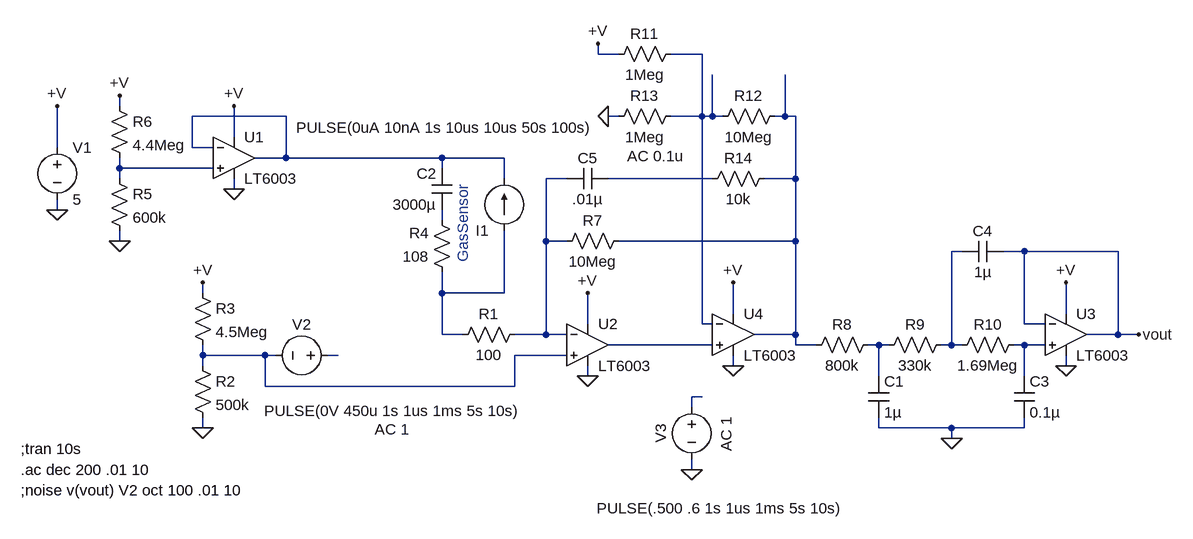
[diagram p0: schematic 6003_H2S_sensor_wFilter_10Meg_decomped in the loop.asc]
6003_H2S_sensor_wFilter_10Meg_decomped in the loop.asc, the LTspice schematic file:
Version 4
SHEET 1 1116 680
WIRE 208 -288 208 -304
WIRE 240 -288 208 -288
WIRE 368 -288 320 -288
WIRE -528 -208 -528 -224
WIRE -272 -192 -416 -192
WIRE 240 -192 224 -192
WIRE 368 -192 368 -288
WIRE 368 -192 320 -192
WIRE 384 -192 384 -256
WIRE 384 -192 368 -192
WIRE 400 -192 384 -192
WIRE 496 -192 496 -256
WIRE 496 -192 480 -192
WIRE 512 -192 496 -192
WIRE -352 -160 -352 -208
WIRE -624 -144 -624 -208
WIRE -416 -144 -416 -192
WIRE -384 -144 -416 -144
WIRE -272 -128 -272 -192
WIRE -272 -128 -320 -128
WIRE -32 -128 -272 -128
WIRE 64 -128 -32 -128
WIRE -528 -112 -528 -128
WIRE -384 -112 -528 -112
WIRE -32 -112 -32 -128
WIRE -528 -96 -528 -112
WIRE 64 -96 64 -128
WIRE 160 -96 128 -96
WIRE 384 -96 224 -96
WIRE 512 -96 512 -192
WIRE 512 -96 464 -96
WIRE -352 -80 -352 -96
WIRE -624 -48 -624 -64
WIRE -32 -32 -32 -48
WIRE -528 0 -528 -16
WIRE 128 0 128 -96
WIRE 160 0 128 0
WIRE 512 0 512 -96
WIRE 512 0 240 0
WIRE 768 16 752 16
WIRE 864 16 832 16
WIRE 1008 16 864 16
WIRE -400 80 -400 64
WIRE -32 80 -32 48
WIRE 64 80 64 -16
WIRE 64 80 -32 80
WIRE 416 112 416 64
WIRE 928 112 928 64
WIRE 192 128 192 80
WIRE 368 128 368 -192
WIRE 384 128 368 128
WIRE 864 128 864 16
WIRE 896 128 864 128
WIRE -32 144 -32 80
WIRE 0 144 -32 144
WIRE 128 144 128 0
WIRE 128 144 80 144
WIRE 160 144 128 144
WIRE 512 144 512 0
WIRE 512 144 448 144
WIRE 1008 144 1008 16
WIRE 1008 144 960 144
WIRE 1040 144 1008 144
WIRE 384 160 224 160
WIRE 512 160 512 144
WIRE 544 160 512 160
WIRE 640 160 624 160
WIRE 656 160 640 160
WIRE 752 160 752 16
WIRE 752 160 736 160
WIRE 768 160 752 160
WIRE 864 160 848 160
WIRE 896 160 864 160
WIRE -400 176 -400 160
WIRE -304 176 -400 176
WIRE -288 176 -304 176
WIRE -192 176 -208 176
WIRE 160 176 80 176
WIRE -400 192 -400 176
WIRE 416 192 416 176
WIRE 928 192 928 176
WIRE 192 208 192 192
WIRE 640 208 640 160
WIRE 864 208 864 160
WIRE -304 224 -304 176
WIRE 80 224 80 176
WIRE 80 224 -304 224
WIRE 368 240 352 240
WIRE 352 256 352 240
WIRE -400 288 -400 272
WIRE 640 288 640 272
WIRE 752 288 640 288
WIRE 864 288 864 272
WIRE 864 288 752 288
WIRE 752 304 752 288
WIRE 352 352 352 336
FLAG -624 -48 0
FLAG -624 -208 +V
FLAG -352 -208 +V
FLAG -352 -80 0
FLAG -528 0 0
FLAG -528 -224 +V
FLAG 192 80 +V
FLAG 192 208 0
FLAG -400 288 0
FLAG -400 64 +V
FLAG 1040 144 vout
FLAG 928 64 +V
FLAG 928 192 0
FLAG 752 304 0
FLAG 352 352 0
FLAG 416 64 +V
FLAG 416 192 0
FLAG 224 -192 0
FLAG 208 -304 +V
SYMBOL voltage -624 -160 R0
WINDOW 123 0 0 Left 2
WINDOW 39 0 0 Left 2
SYMATTR InstName V1
SYMATTR Value 5
SYMBOL cap -16 -112 M0
SYMATTR InstName C2
SYMATTR Value 3000µ
SYMBOL Opamps\\LT6003 -352 -128 R0
SYMATTR InstName U1
SYMBOL res -544 -112 R0
SYMATTR InstName R5
SYMATTR Value 600k
SYMBOL res -544 -224 R0
SYMATTR InstName R6
SYMATTR Value 4.4Meg
SYMBOL res 96 128 R90
WINDOW 0 0 56 VBottom 2
WINDOW 3 32 56 VTop 2
SYMATTR InstName R1
SYMATTR Value 100
SYMBOL res -416 176 R0
SYMATTR InstName R2
SYMATTR Value 500k
SYMBOL res -416 64 R0
SYMATTR InstName R3
SYMATTR Value 4.5Meg
SYMBOL res -16 64 R180
WINDOW 0 36 76 Left 2
WINDOW 3 36 40 Left 2
SYMATTR InstName R4
SYMATTR Value 108
SYMBOL res 256 -16 R90
WINDOW 0 0 56 VBottom 2
WINDOW 3 32 56 VTop 2
SYMATTR InstName R7
SYMATTR Value 10Meg
SYMBOL voltage -192 176 R90
WINDOW 0 -32 56 VBottom 2
WINDOW 3 70 -83 VTop 2
WINDOW 123 98 -83 VTop 2
WINDOW 39 0 0 Left 2
SYMATTR InstName V2
SYMATTR Value PULSE(0V 450u 1s 1us 1ms 5s 10s)
SYMATTR Value2 AC 1
SYMBOL Opamps\\LT6003 928 144 R0
SYMATTR InstName U3
SYMBOL res 640 144 R90
WINDOW 0 0 56 VBottom 2
WINDOW 3 32 56 VTop 2
SYMATTR InstName R8
SYMATTR Value 800k
SYMBOL res 752 144 R90
WINDOW 0 0 56 VBottom 2
WINDOW 3 32 56 VTop 2
SYMATTR InstName R9
SYMATTR Value 330k
SYMBOL res 864 144 R90
WINDOW 0 0 56 VBottom 2
WINDOW 3 32 56 VTop 2
SYMATTR InstName R10
SYMATTR Value 1.69Meg
SYMBOL cap 624 208 R0
SYMATTR InstName C1
SYMATTR Value 1µ
SYMBOL cap 848 208 R0
SYMATTR InstName C3
SYMATTR Value 0.1µ
SYMBOL cap 832 0 R90
WINDOW 0 0 32 VBottom 2
WINDOW 3 32 32 VTop 2
SYMATTR InstName C4
SYMATTR Value 1µ
SYMBOL voltage 352 240 R0
WINDOW 0 -32 56 VBottom 2
WINDOW 3 43 156 Top 2
WINDOW 123 38 57 VTop 2
WINDOW 39 0 0 Left 2
SYMATTR InstName V3
SYMATTR Value PULSE(.500 .6 1s 1us 1ms 5s 10s)
SYMATTR Value2 AC 1
SYMBOL current 64 -16 R180
WINDOW 3 -136 159 Left 2
WINDOW 123 -276 115 Left 2
WINDOW 39 0 0 Left 2
SYMATTR Value PULSE(0uA 10nA 1s 10us 10us 50s 100s)
SYMATTR Value2 AC 0.1u
SYMATTR InstName I1
SYMBOL cap 224 -112 R90
WINDOW 0 0 32 VBottom 2
WINDOW 3 32 32 VTop 2
SYMATTR InstName C5
SYMATTR Value .01µ
SYMBOL Opamps\\LT6003 192 160 R0
SYMATTR InstName U2
SYMBOL Opamps\\LT6003 416 144 R0
SYMATTR InstName U4
SYMBOL res 224 -272 R270
WINDOW 0 32 56 VTop 2
WINDOW 3 0 56 VBottom 2
SYMATTR InstName R11
SYMATTR Value 1Meg
SYMBOL res 384 -176 R270
WINDOW 0 32 56 VTop 2
WINDOW 3 0 56 VBottom 2
SYMATTR InstName R12
SYMATTR Value 10Meg
SYMBOL res 224 -176 R270
WINDOW 0 32 56 VTop 2
WINDOW 3 0 56 VBottom 2
SYMATTR InstName R13
SYMATTR Value 1Meg
SYMBOL res 368 -80 R270
WINDOW 0 32 56 VTop 2
WINDOW 3 0 56 VBottom 2
SYMATTR InstName R14
SYMATTR Value 10k
TEXT -680 352 Left 2 !.ac dec 200 .01 10
TEXT -680 320 Left 2 !;tran 10s
TEXT -680 384 Left 2 !;noise v(vout) V2 oct 100 .01 10
TEXT 0 -88 VRight 2 ;GasSensor

The netlist it stands for:
* 6003_H2S_sensor_wFilter_10Meg_decomped in the loop.asc
V1 +V 0 5
C2 N002 N007 3000µ
* U1: LT6003 (symbol Opamps\LT6003 not available, pins judged from their places): In+=N004 In-=N002 V+=+V V-=0 OUT=N002
R5 N004 0 600k
R6 +V N004 4.4Meg
R1 N005 N009 100
R2 N013 0 500k
R3 +V N013 4.5Meg
R4 N009 N007 108
R7 N003 N005 10Meg
V2 N014 N013 PULSE(0V 450u 1s 1us 1ms 5s 10s) AC 1
* U3: LT6003 (symbol Opamps\LT6003 not available, pins judged from their places): In+=N012 In-=vout V+=+V V-=0 OUT=vout
R8 N011 N003 800k
R9 N008 N011 330k
R10 N012 N008 1.69Meg
C1 N011 0 1µ
C3 N012 0 0.1µ
C4 vout N008 1µ
V3 N015 0 PULSE(.500 .6 1s 1us 1ms 5s 10s) AC 1
I1 N009 N002 PULSE(0uA 10nA 1s 10us 10us 50s 100s) AC 0.1u
C5 N006 N005 .01µ
* U2: LT6003 (symbol Opamps\LT6003 not available, pins judged from their places): In+=N013 In-=N005 V+=+V V-=0 OUT=N010
* U4: LT6003 (symbol Opamps\LT6003 not available, pins judged from their places): In+=N010 In-=N001 V+=+V V-=0 OUT=N003
R11 +V N001 1Meg
R12 N001 N003 10Meg
R13 0 N001 1Meg
R14 N006 N003 10k
.ac dec 200 .01 10
;tran 10s
;noise v(vout) V2 oct 100 .01 10
* GasSensor
.backanno
.end